# EAGLE design touch_RevA (EAGLE 6.5.0)
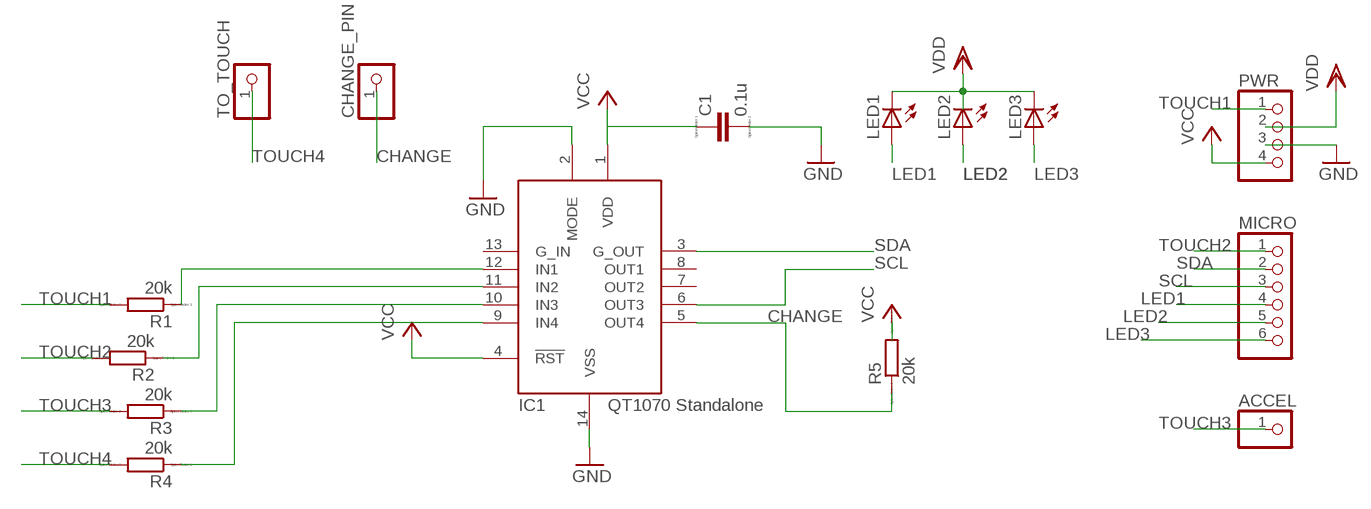
[diagram p0: schematic, sheet 1]

## Parts
ACCEL  PINHD-1X1  [1X01]
C1  0.1u  CC0603  [C0603]
CHANGE_PIN  PINHD-1X1  [1X01]
IC1  AT42QT1070-SSU  [SO14]
LED1  LEDP-LCC-4  [P-LCC-4]
LED2  LEDP-LCC-4  [P-LCC-4]
LED3  LEDP-LCC-4  [P-LCC-4]
MICRO  PINHD-1X6  [1X06]
PWR  PINHD-1X4  [1X04]
R1  20k  RR0603  [R0603]
R2  20k  RR0603  [R0603]
R3  20k  RR0603  [R0603]
R4  20k  RR0603  [R0603]
R5  20k  RR0603  [R0603]
TO_TOUCH  PINHD-1X1  [1X01]

## Nets
CHANGE: CHANGE_PIN.1 IC1.5(OUT4) R5.1
GND: C1.2 IC1.2(MODE) IC1.14(VSS) PWR.3
LED1: LED1.A MICRO.4
LED2: LED2.A MICRO.5
LED3: LED3.A MICRO.6
N$7: IC1.12(IN1) R1.1
N$8: IC1.11(IN2) R2.1
N$9: IC1.10(IN3) R3.1
N$10: IC1.9(IN4) R4.1
SCL: IC1.6(OUT3) MICRO.3
SDA: IC1.3(G_OUT) MICRO.2
TOUCH1: PWR.1 R1.2
TOUCH2: MICRO.1 R2.2
TOUCH3: ACCEL.1 R3.2
TOUCH4: R4.2 TO_TOUCH.1
VCC: C1.1 IC1.1(VDD) IC1.4(!RST) PWR.4 R5.2
VDD: LED1.C@4(C) LED2.C@4(C) LED3.C@4(C) PWR.2
Unconnected: IC1.7(OUT2) IC1.8(OUT1) IC1.13(G_IN)

## Library data of the parts
ACCEL CHANGE_PIN TO_TOUCH = pinhead:PINHD-1X1: PIN HEADER
C1 = eagle-ltspice:C: CAPACITOR, European symbol; SPICEMODEL: NONE; SPICEPREFIX: C
IC1 = adafruit:AT42QT1070: QTouch 5-channel standalone sensor IC AT42QT1070 in standalone mode has 5 inputs (guard + 4 key) and open drain outputs. 1.8V-5.5V power.
LED1-LED3 = led:LED: LED OSRAM: - CHIPLED LG R971, LG N971, LY N971, LG Q971, LY Q971, LO R971, LY R971 LH N974, LH R974 LS Q976, LO Q976, LY Q976 LO Q996 - Hyper CHIPLED LW Q18S LB Q993, LB Q99A, LB R99A - SideLED LS A670, LO A670, LY A670, LG A670, LP A670 LB A673, LV A673, LT A673, LW A673 LH A674 LY A675 LS A676, LA A676, LO A676, LY A676, LW A676 LS A679, LY A679, LG A679 - Hyper Micro SIDELED® LS Y876, LA Y876, LO Y876, LY Y876 LT Y87S - SmartLED LW L88C, LW L88S LB L89C, LB L89S, LG L890 LS L89K, LO L89K, LY L89K LS L896, LA L896, LO L896, LY L896 - TOPLED LS T670, LO T670, LY T670, LG T670, LP T670 LSG T670, LSP T670, LSY T670, LOP T670, LYG T670 LG T671, LOG T671, LSG T671 LB T673, LV T673, LT T673, LW T673 LH T674 LS T676, LA T676, LO T676, LY T676, LB T676, LH T676, LSB T676, LW T676 LB T67C, LV T67C, LT T67C, LS T67K, LO T67K, LY T67K, LW E67C LS E67B, LA E67B, LO E67B, LY E67B, LB E67C, LV E67C, LT E67C LW T67C LS T679, LY T679, LG T679 LS T770, LO T770, LY T770, LG T770, LP T770 LB T773, LV T773, LT T773, LW T773 LH T774 LS E675, LA E675, LY E675, LS T675 LS T776, LA T776, LO T776, LY T776, LB T776 LHGB T686 LT T68C, LB T68C - Hyper Mini TOPLED® LB M676 - Mini TOPLED Santana® LG M470 LS M47K, LO M47K, LY M47K Source: http://www.osram.convergy.de LUXEON: - LUMILED® LXK2-PW12-R00, LXK2-PW12-S00, LXK2-PW14-U00, LXK2-PW14-V00 LXK2-PM12-R00, LXK2-PM12-S00, LXK2-PM14-U00 LXK2-PE12-Q00, LXK2-PE12-R00, LXK2-PE12-S00, LXK2-PE14-T00, LXK2-PE14-U00 LXK2-PB12-K00, LXK2-PB12-L00, LXK2-PB12-M00, LXK2-PB14-N00, LXK2-PB14-P00, LXK2-PB14-Q00 LXK2-PR12-L00, LXK2-PR12-M00, LXK2-PR14-Q00, LXK2-PR14-R00 LXK2-PD12-Q00, LXK2-PD12-R00, LXK2-PD12-S00 LXK2-PH12-R00, LXK2-PH12-S00 LXK2-PL12-P00, LXK2-PL12-Q00, LXK2-PL12-R00 Source: www.luxeon.com KINGBRIGHT: KA-3528ASYC Source: www.kingbright.com
MICRO = pinhead:PINHD-1X6: PIN HEADER
PWR = pinhead:PINHD-1X4: PIN HEADER
R1-R5 = eagle-ltspice:R: RESISTOR, European symbol; SPICEMODEL: NONE; SPICEPREFIX: R

## Board
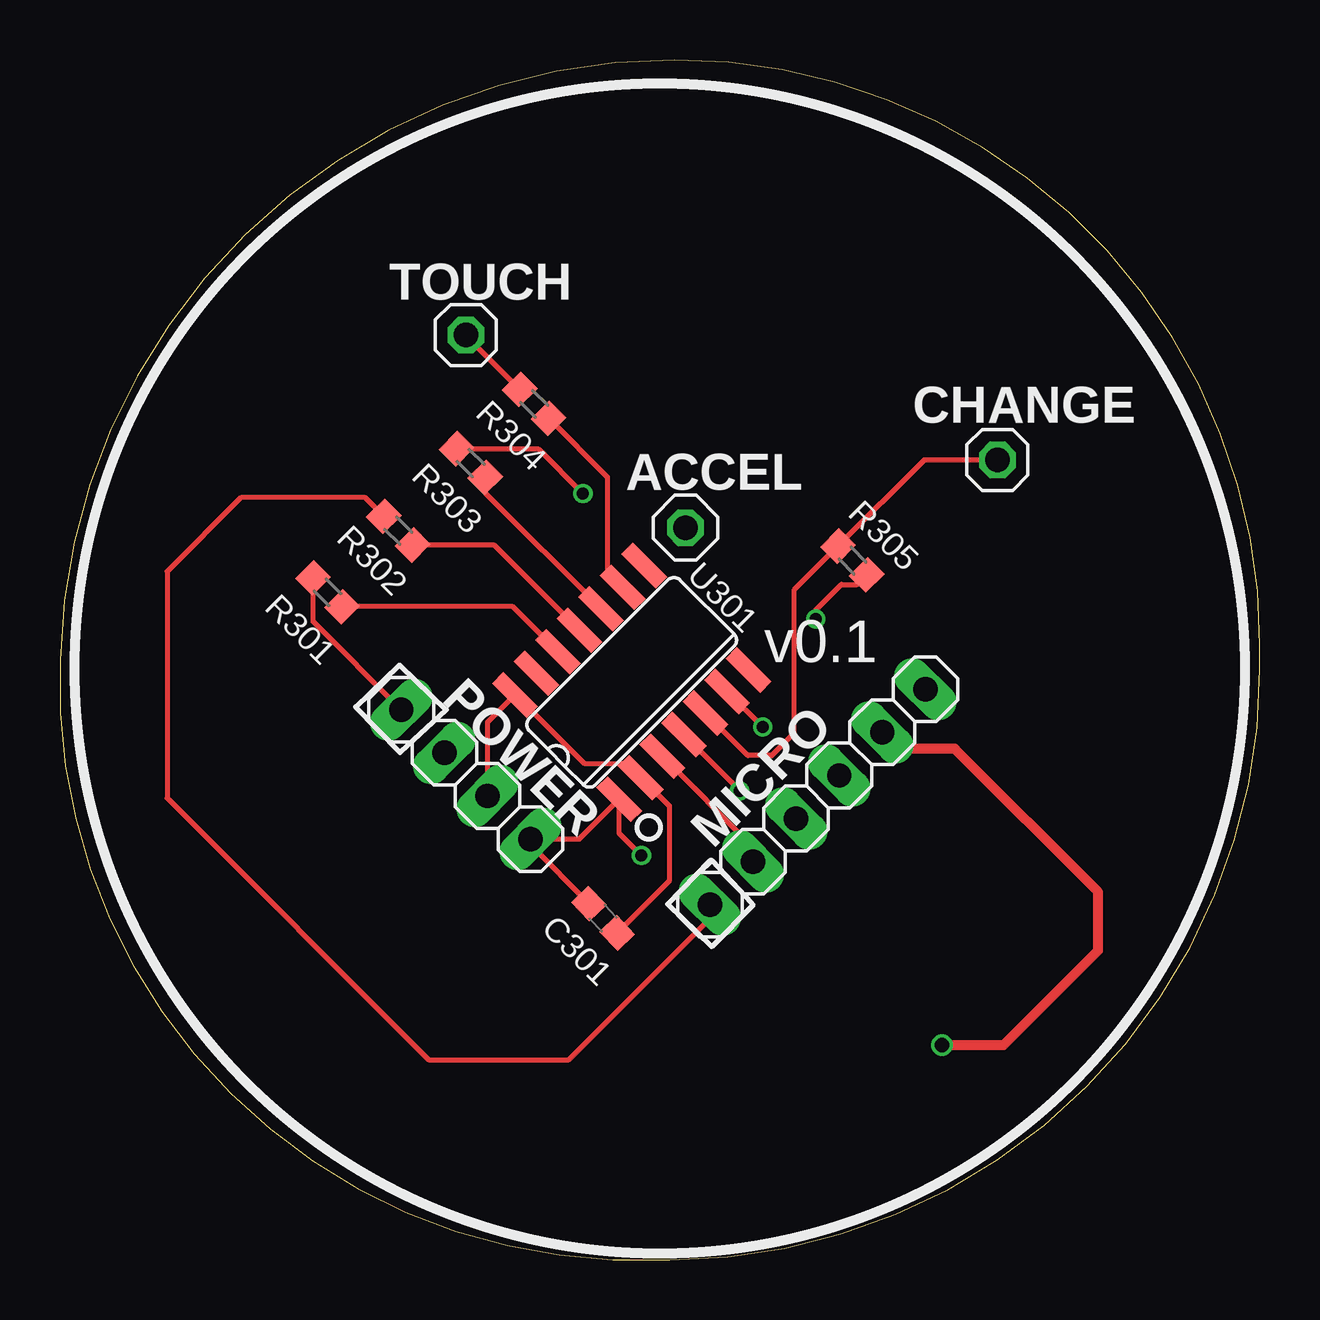
[diagram p1: board, top side]
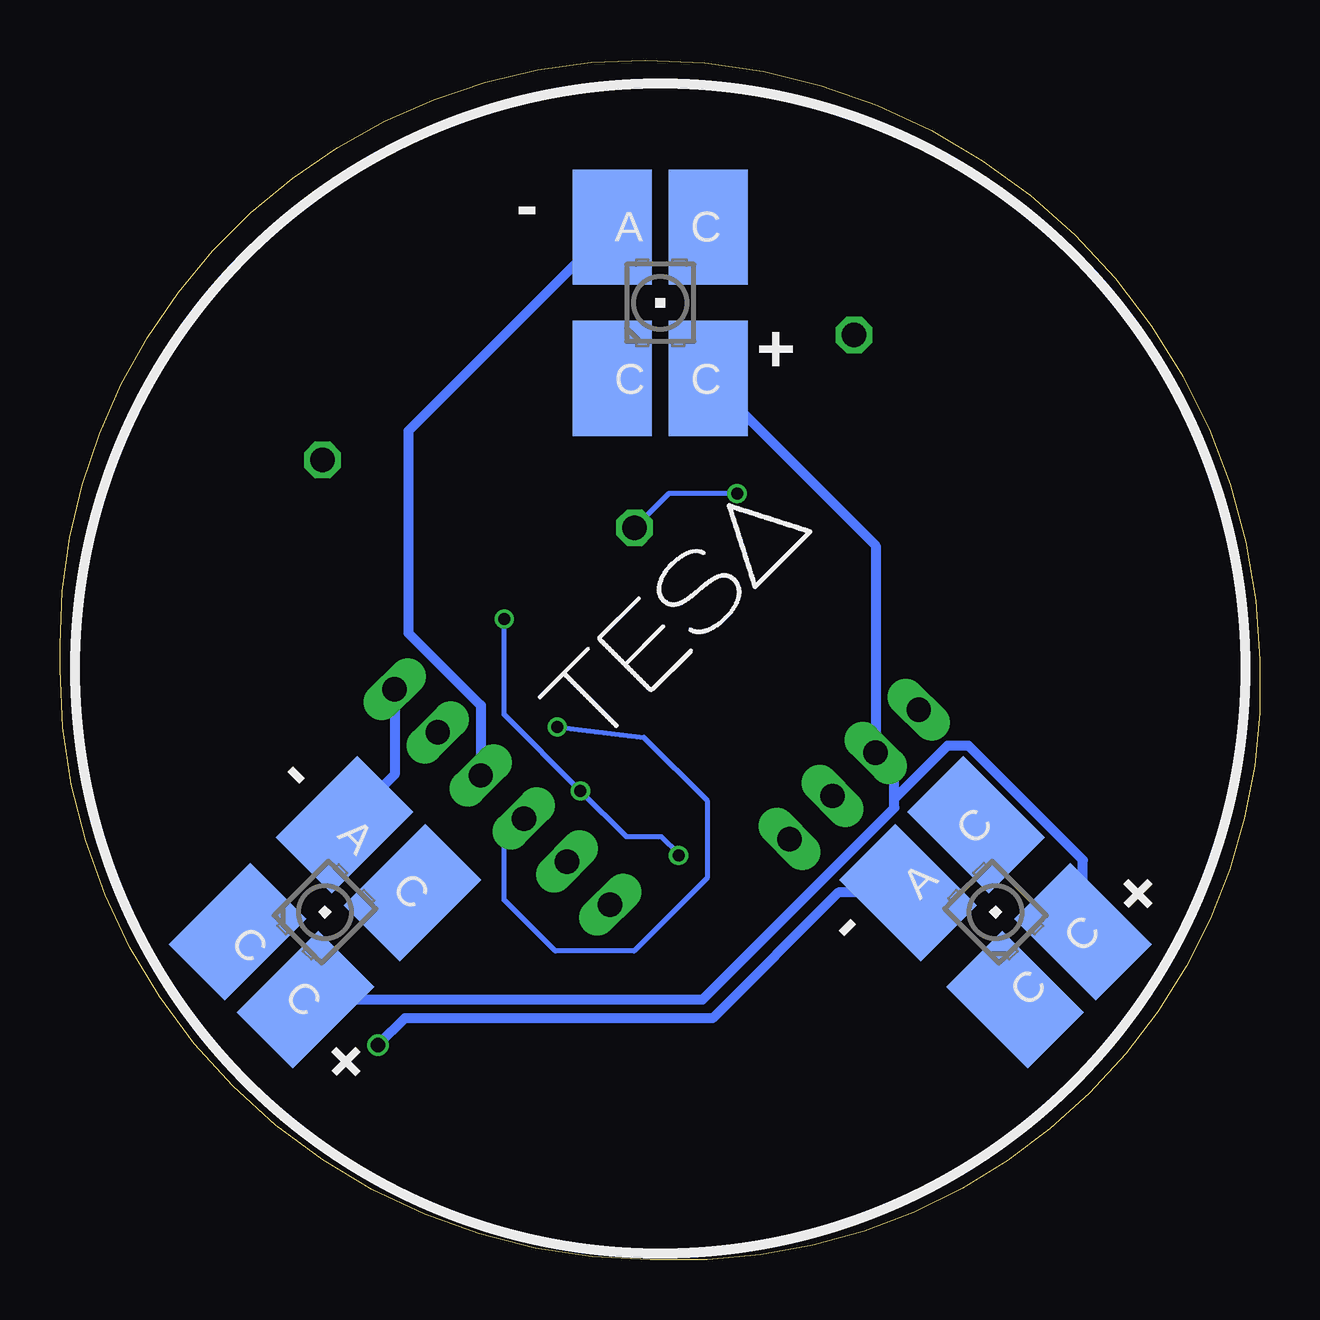
[diagram p2: board, bottom side, seen from below]

Size 50 x 50 mm. Coordinates in mm from the lower left corner, seen from the top.
Outline: 0,25 arc90 23.02,0 25.4,0 arc90 50,24.6 50,25.61 arc90 25.61,50 arc89 0,25
Copper layers (1*16): Top 0.035mm / dielectric 1.5mm / Bottom 0.035mm
Design rules "ITEADstudio_DRC": minimum track width 6mil, minimum drill 12mil, track to track 6mil, track to pad 6mil, pad to pad 6mil, via to via 6mil, smd to smd 0mil, copper to edge 10mil, drill to drill 10mil, minimum pad ring 10mil, minimum via ring 6mil, stop-mask expansion 2mil, vias tented up to drill 100mil, thermal gap 10mil

### Footprints (pad centres in the part's own frame; a part is rotated, then mirrored left to right if it is on the bottom)
1X01 = drill 1.016 octagon: 1 0,0
C0603 = smd 1.1 x 1: 1 -0.85,0; 2 0.85,0
SO14 = smd 0.66 x 2.032: 1 -3.81,-3.073; 2 -2.54,-3.073; 3 -1.27,-3.073; 4 0,-3.073; 5 1.27,-3.073; 6 2.54,-3.073; 7 3.81,-3.073; 8 3.81,3.073; 9 2.54,3.073; 10 1.27,3.073; 11 0,3.073; 12 -1.27,3.073; 13 -2.54,3.073; 14 -3.81,3.073
P-LCC-4 = smd 3.3 x 4.8: A -2,3.15; C@1 -2,-3.15; C@3 2,3.15; C@4 2,-3.15
1X06 = drill 1.016 long: 1 -6.35,0; 2 -3.81,0; 3 -1.27,0; 4 1.27,0; 5 3.81,0; 6 6.35,0
1X04 = drill 1.016 long: 1 -3.81,0; 2 -1.27,0; 3 1.27,0; 4 3.81,0
R0603 = smd 1 x 1.1: 1 -0.85,0; 2 0.85,0

### Placement (x,y rotation side)
ACCEL  26.06,30.51 225 top
C1  22.63,14.23 313.8 top
CHANGE_PIN  39.06,33.33 0 top
IC1  23.82,24.06 45 top
LED1  24.99,39.88 0 bottom
LED2  11.02,14.48 45 bottom
LED3  38.96,14.48 315 bottom
MICRO  31.57,19.28 45 top
PWR  16.91,20.22 315 top
R1  11.15,27.82 135 top
R2  14.09,30.38 135 top
R3  17.12,33.2 135 top
R4  19.76,35.66 135 top
R5  33.02,29.14 315 top
TO_TOUCH  16.91,38.53 0 top

### Tracks (layer width: path | path; a pad name or v marks a point on that pad's centre or on a via)
CHANGE
  Top 0.203: IC1.5 28.67,21.01 29.66,21.01 30.58,21.92 30.58,27.9 R5.1 36,33.33 CHANGE_PIN.1
GND
  Top 0.203: C1.2 25.4,15.79 25.4,18.89 IC1.2 23.61,20.68 21.84,20.68 18.98,23.54 IC1.14 17.81,22.39 PWR.3
LED1
  Bottom 0.406: LED1.A 35.48,34.54 35.48,26.11 32.47,23.1 MICRO.4
LED2  (via drill 0.6 pad 0.2)
  Top 0.406: v36.75,8.94 39.32,8.94 43.25,12.88 43.25,15.32 37.28,21.29 35,21.29 34.31,21.98 MICRO.5
  Bottom 0.406: LED2.A 17.57,15.29 22.81,10.06 35.63,10.06 v36.75,8.94
LED3
  Bottom 0.406: MICRO.6 36.06,20.21 LED3.A
N$7
  Top 0.203: IC1.12 18.87,27.21 R1.1
N$8
  Top 0.203: IC1.11 18.1,29.78 R2.1
N$9
  Top 0.203: R3.1 17.72,31.96 IC1.10
N$10
  Top 0.203: R4.1 22.81,32.62 22.81,28.66 IC1.9
SCL  (via drill 0.5 pad 0.2)
  Top 0.203: IC1.6 27.79,23.67 v29.28,22.2
  Bottom 0.203: v29.28,22.2 25.68,21.77 23.03,19.13 23.03,15.9 26.08,12.85 29.36,12.85 31.49,14.99 31.49,17.56 MICRO.3
SDA
  Top 0.203: MICRO.2 28.87,17.21 IC1.3
TOUCH1
  Top 0.203: PWR.1 10.55,26.59 R1.2
TOUCH2
  Top 0.203: R2.2 12.72,31.75 7.54,31.75 4.47,28.68 4.47,19.23 15.36,8.33 21.2,8.33 27.08,14.21 MICRO.1
TOUCH3  (via drill 0.5 pad 0.2)
  Top 0.203: R3.2 19.92,33.8 v21.79,31.93
  Bottom 0.203: v21.79,31.93 24.63,31.93 ACCEL.1
TOUCH4
  Top 0.203: TO_TOUCH.1 16.91,38.51 R4.2
VCC  (via drill 0.5 pad 0.2)
  Top 0.203: C1.1 19.61,17.27 PWR.4 21.64,17.53 IC1.1 23.3,17.77 v24.23,16.84 | IC1.4 28.32,19.56 v28.32,19.54 | v31.49,26.7 31.49,27.08 32.56,28.15 33.23,28.15 R5.2
  Bottom 0.203: v24.23,16.84 24.23,16.92 24.94,17.63 26.41,17.63 v28.32,19.54 31.49,22.71 v31.49,26.7
VDD
  Bottom 0.406: LED3.C@4 23.22,10.84 15.24,18.82 15.24,19.2 | 15.24,19.2 15.24,20.34 PWR.2 16.01,29.76 LED1.C@4 | LED2.C@4 7.38,16.66 12.14,21.41 13.03,21.41 15.24,19.2
(copper drawn outside any net)
  shapes: Bottom area x684

### Text on the board
tPlace: TOUCH | CHANGE | R304 | ACCEL | R303 | R305 | R302 | U301 | R301 | v0.1 | POWER | MICRO | C301
bPlace: - | + | - | + | - | +